# Altium schematic sheet 8Channel_Base.SchDoc: 8CH-ADS1299
size A4; Author: 郑宇博; DrawnBy: Zheng; DocumentNumber: 1; Revision: 3; SheetNumber: 1; SheetTotal: 4
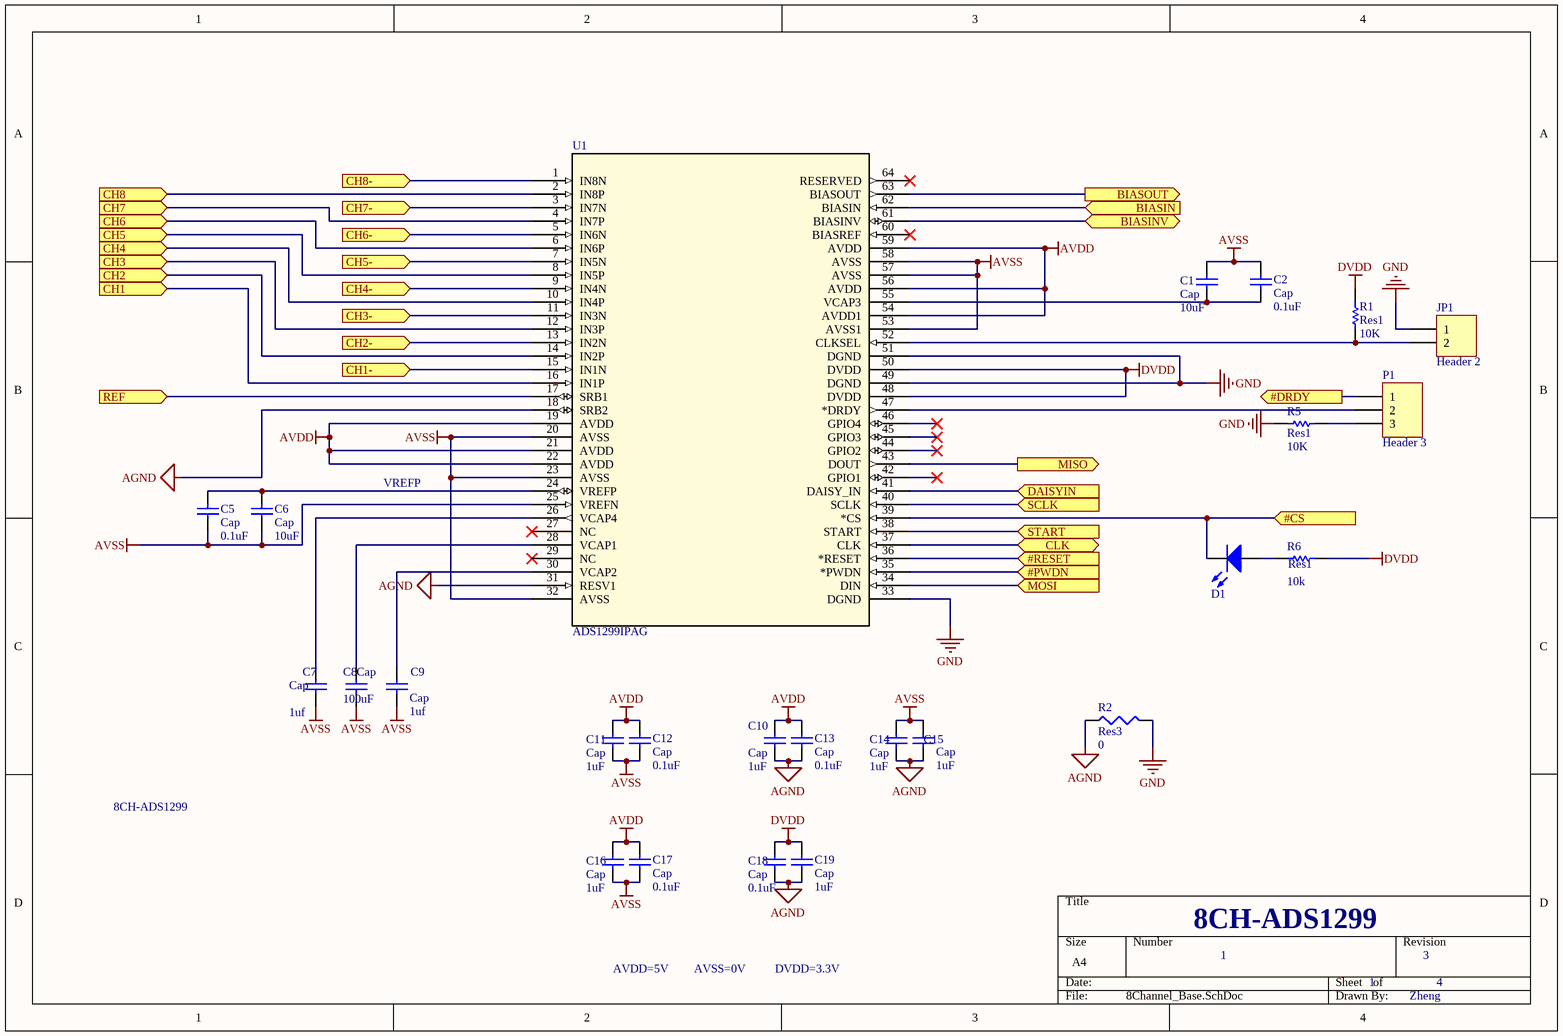
[diagram p0: 8Channel_Base.SchDoc]

## Parts
C1  Cap  value 10uF  [0603]
C2  Cap  value 0.1uF  [0402C]
C5  Cap  value 0.1uF  [0402C]
C6  Cap  value 10uF  [0603]
C7  Cap  value 1uf  [0402C]
C8  Cap  value 100uF  [14-1210]
C9  Cap  value 1uf  [0402C]
C10  Cap  value 1uF  [0402C]
C11  Cap  value 1uF  [0402C]
C12  Cap  value 0.1uF  [0402C]
C13  Cap  value 0.1uF  [0402C]
C14  Cap  value 1uF  [0402C]
C15  Cap  value 1uF  [0402C]
C16  Cap  value 1uF  [0402C]
C17  Cap  value 0.1uF  [0402C]
C18  Cap  value 0.1uF  [0402C]
C19  Cap  value 1uF  [0402C]
D1  LED  [LED_0603_G]  (value not drawn)
JP1  Header 2  [HDR1X2]
P1  Header 3  [HDR1X3]
R1  Res1  value 10K  [0603]
R2  Res3  value 0  [0603]
R5  Res1  value 10K  [0603]
R6  Res1  value 10k  [0603]
U1  ADS1299IPAG  [PAG64_TEX]

## Ports
#CS (in), #DRDY (out), #PWDN (in), #RESET (in), BIASIN (in), BIASINV (bidir), BIASOUT (out), CH1 (in), CH1- (in), CH2 (in), CH2- (in), CH3 (in), CH3- (in), CH4 (in), CH4- (in), CH5 (in), CH5- (in), CH6 (in), CH6- (in), CH7 (in), CH7- (in), CH8 (in), CH8- (in), CLK (bidir), DAISYIN (in), MISO (out), MOSI (in), REF (in), SCLK (in), START (in)

## Nets
AGND: C10.2 C13.2 C14.1 C15.1 C18.2 C19.2 R2.2 U1.18(SRB2) U1.31(RESV1)
AVDD: C10.1 C11.2 C12.2 C13.1 C16.2 C17.2 U1.19(AVDD) U1.21(AVDD) U1.22(AVDD) U1.54(AVDD1) U1.56(AVDD) U1.59(AVDD)
AVSS: C1.2 C2.2 C5.1 C6.1 C7.1 C8.1 C9.1 C11.1 C12.1 C14.2 C15.2 C16.1 C17.1 U1.20(AVSS) U1.23(AVSS) U1.25(VREFN) U1.32(AVSS) U1.53(AVSS1) U1.57(AVSS) U1.58(AVSS)
DVDD: C18.1 C19.1 R1.2 R6.2 U1.48(DVDD) U1.50(DVDD)
GND: JP1.1 R2.1 R5.1 U1.33(DGND) U1.49(DGND) U1.51(DGND)
#CS: D1.2(K) U1.39(*CS) ; port #CS
#DRDY: P1.1 ; port #DRDY
#PWDN: U1.35(*PWDN) ; port #PWDN
#RESET: U1.36(*RESET) ; port #RESET
BIASIN: U1.62(BIASIN) ; port BIASIN
BIASINV: U1.61(BIASINV) ; port BIASINV
BIASOUT: U1.63(BIASOUT) ; port BIASOUT
CH1: U1.16(IN1P) ; port CH1
CH1-: U1.15(IN1N) ; port CH1-
CH2: U1.14(IN2P) ; port CH2
CH2-: U1.13(IN2N) ; port CH2-
CH3: U1.12(IN3P) ; port CH3
CH3-: U1.11(IN3N) ; port CH3-
CH4: U1.10(IN4P) ; port CH4
CH4-: U1.9(IN4N) ; port CH4-
CH5: U1.8(IN5P) ; port CH5
CH5-: U1.7(IN5N) ; port CH5-
CH6: U1.6(IN6P) ; port CH6
CH6-: U1.5(IN6N) ; port CH6-
CH7: U1.4(IN7P) ; port CH7
CH7-: U1.3(IN7N) ; port CH7-
CH8: U1.2(IN8P) ; port CH8
CH8-: U1.1(IN8N) ; port CH8-
CLK: U1.37(CLK) ; port CLK
DAISYIN: U1.41(DAISY_IN) ; port DAISYIN
MISO: U1.43(DOUT) ; port MISO
MOSI: U1.34(DIN) ; port MOSI
REF: U1.17(SRB1) ; port REF
SCLK: U1.40(SCLK) ; port SCLK
START: U1.38(START) ; port START
NetC1_1: C1.1 C2.1 U1.55(VCAP3)
NetC5_2: C5.2 C6.2 U1.24(VREFP)
NetC7_2: C7.2 U1.26(VCAP4)
NetC8_2: C8.2 U1.28(VCAP1)
NetC9_2: C9.2 U1.30(VCAP2)
NetD1_1: D1.1(A) R6.1
NetJP1_2: JP1.2 R1.1 U1.52(CLKSEL)
NetP1_2: P1.2 U1.47(*DRDY)
NetP1_3: P1.3 R5.2

Not connected (* = marked no-connect by the designer): U1 27(NC)* 29(NC)* 42(GPIO1)* 44(GPIO2)* 45(GPIO3)* 46(GPIO4)* 60(BIASREF)* 64(RESERVED)*

## Notes on the sheet
- VREFP
- AVDD=5V
- AVSS=0V
- DVDD=3.3V
- Title
- Size:
- Date:
- A4
- Number:
- Time:
- Revision:
- Sheet
- of
- File:

## Library data of the parts
C1 C2 C5-C19 = Cap: Capacitor; Published: 8-Jun-2000; LatestRevisionDate: 17-Jul-2002; LatestRevisionNote: Re-released for DXP Platform.; PackageReference: RAD-0.3; Publisher: Altium Limited; PackageDescription: Radial Cap, Thru-Hole; 2 Leads; 0.3 in Pin Spacing
D1 = LED: Value: 0603-RED; Published: 8-Jun-2000; LatestRevisionDate: 08-Jul-2005; LatestRevisionNote: Mech Layer 1 removed.; PackageReference: 0603; Publisher: JonesLee; PackageDescription: LED; 2 Leads; Package: 0603
JP1 = Header 2: Header, 2-Pin; LatestRevisionDate: 17-Jul-2002; LatestRevisionNote: Re-released for DXP Platform.; Publisher: Altium Limited
P1 = Header 3: Header, 3-Pin; LatestRevisionDate: 17-Jul-2002; LatestRevisionNote: Re-released for DXP Platform.; Publisher: Altium Limited
R1 R5 R6 = Res1: Resistor; Published: 8-Jun-2000; LatestRevisionDate: 17-Jul-2002; LatestRevisionNote: Re-released for DXP Platform.; PackageReference: AXIAL-0.3; Publisher: Altium Limited; PackageDescription: Axial Device, Thru-Hole; 2 Leads; 0.3 in Pin Spacing
R2 = Res3: Resistor; Published: 8-Jun-2000; LatestRevisionDate: 29-May-2009; LatestRevisionNote: IPC-7351 Footprint Added.; PackageReference: J1-0603; Publisher: Altium Limited; PackageDescription: Chip Resistor
U1 = ADS1299IPAG: No Description Available; Mfr_Name: Texas Instruments; Copyright: Copyright (C) 2021 Ultra Librarian. All rights reserved.; Manufacturer_Part_Number: ADS1299IPAG; RefDes: RefDes; Type: DEV